# Altium schematic sheet SWD_v1.0.SchDoc
size 55 x 30 mm
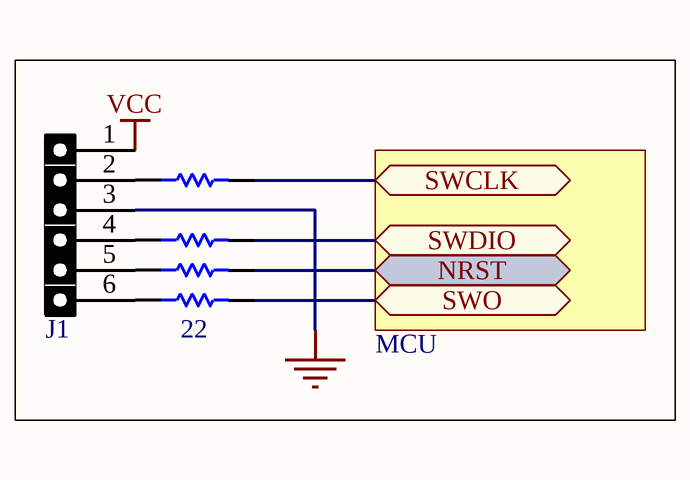
[diagram p0: SWD_v1.0.SchDoc]

## Parts
J1  Connector_1x6Pin_Female  [HEADER_THD_STAND_FEMALE_1X6]  (value not drawn)
R1  22  [SMD_0805]  (value not drawn)
R2  22  [SMD_0805]  (value not drawn)
R3  22  [SMD_0805]  (value not drawn)
R4  22  [SMD_0805]

## Ports
NRST, SWCLK, SWDIO, SWO

## Nets
GND: J1.3
VCC: J1.1
NRST: R3.1 ; port NRST
SWCLK: R1.1 ; port SWCLK
SWDIO: R2.1 ; port SWDIO
SWO: R4.1 ; port SWO
NetJ1_2: J1.2 R1.2
NetJ1_4: J1.4 R2.2
NetJ1_5: J1.5 R3.2
NetJ1_6: J1.6 R4.2

## Notes on the sheet
- MCU

## Library data of the parts
J1 = Connector_1x6Pin_Female: Connector, Header, 6Pin
R1-R4 = Resistor: Resistor, 1/4W, 5%; Revision: July-2002: Re-released for DXP Platform.